# EasyEDA Pro project 电机舵机DCDC驱动板.eprj, board PCB1
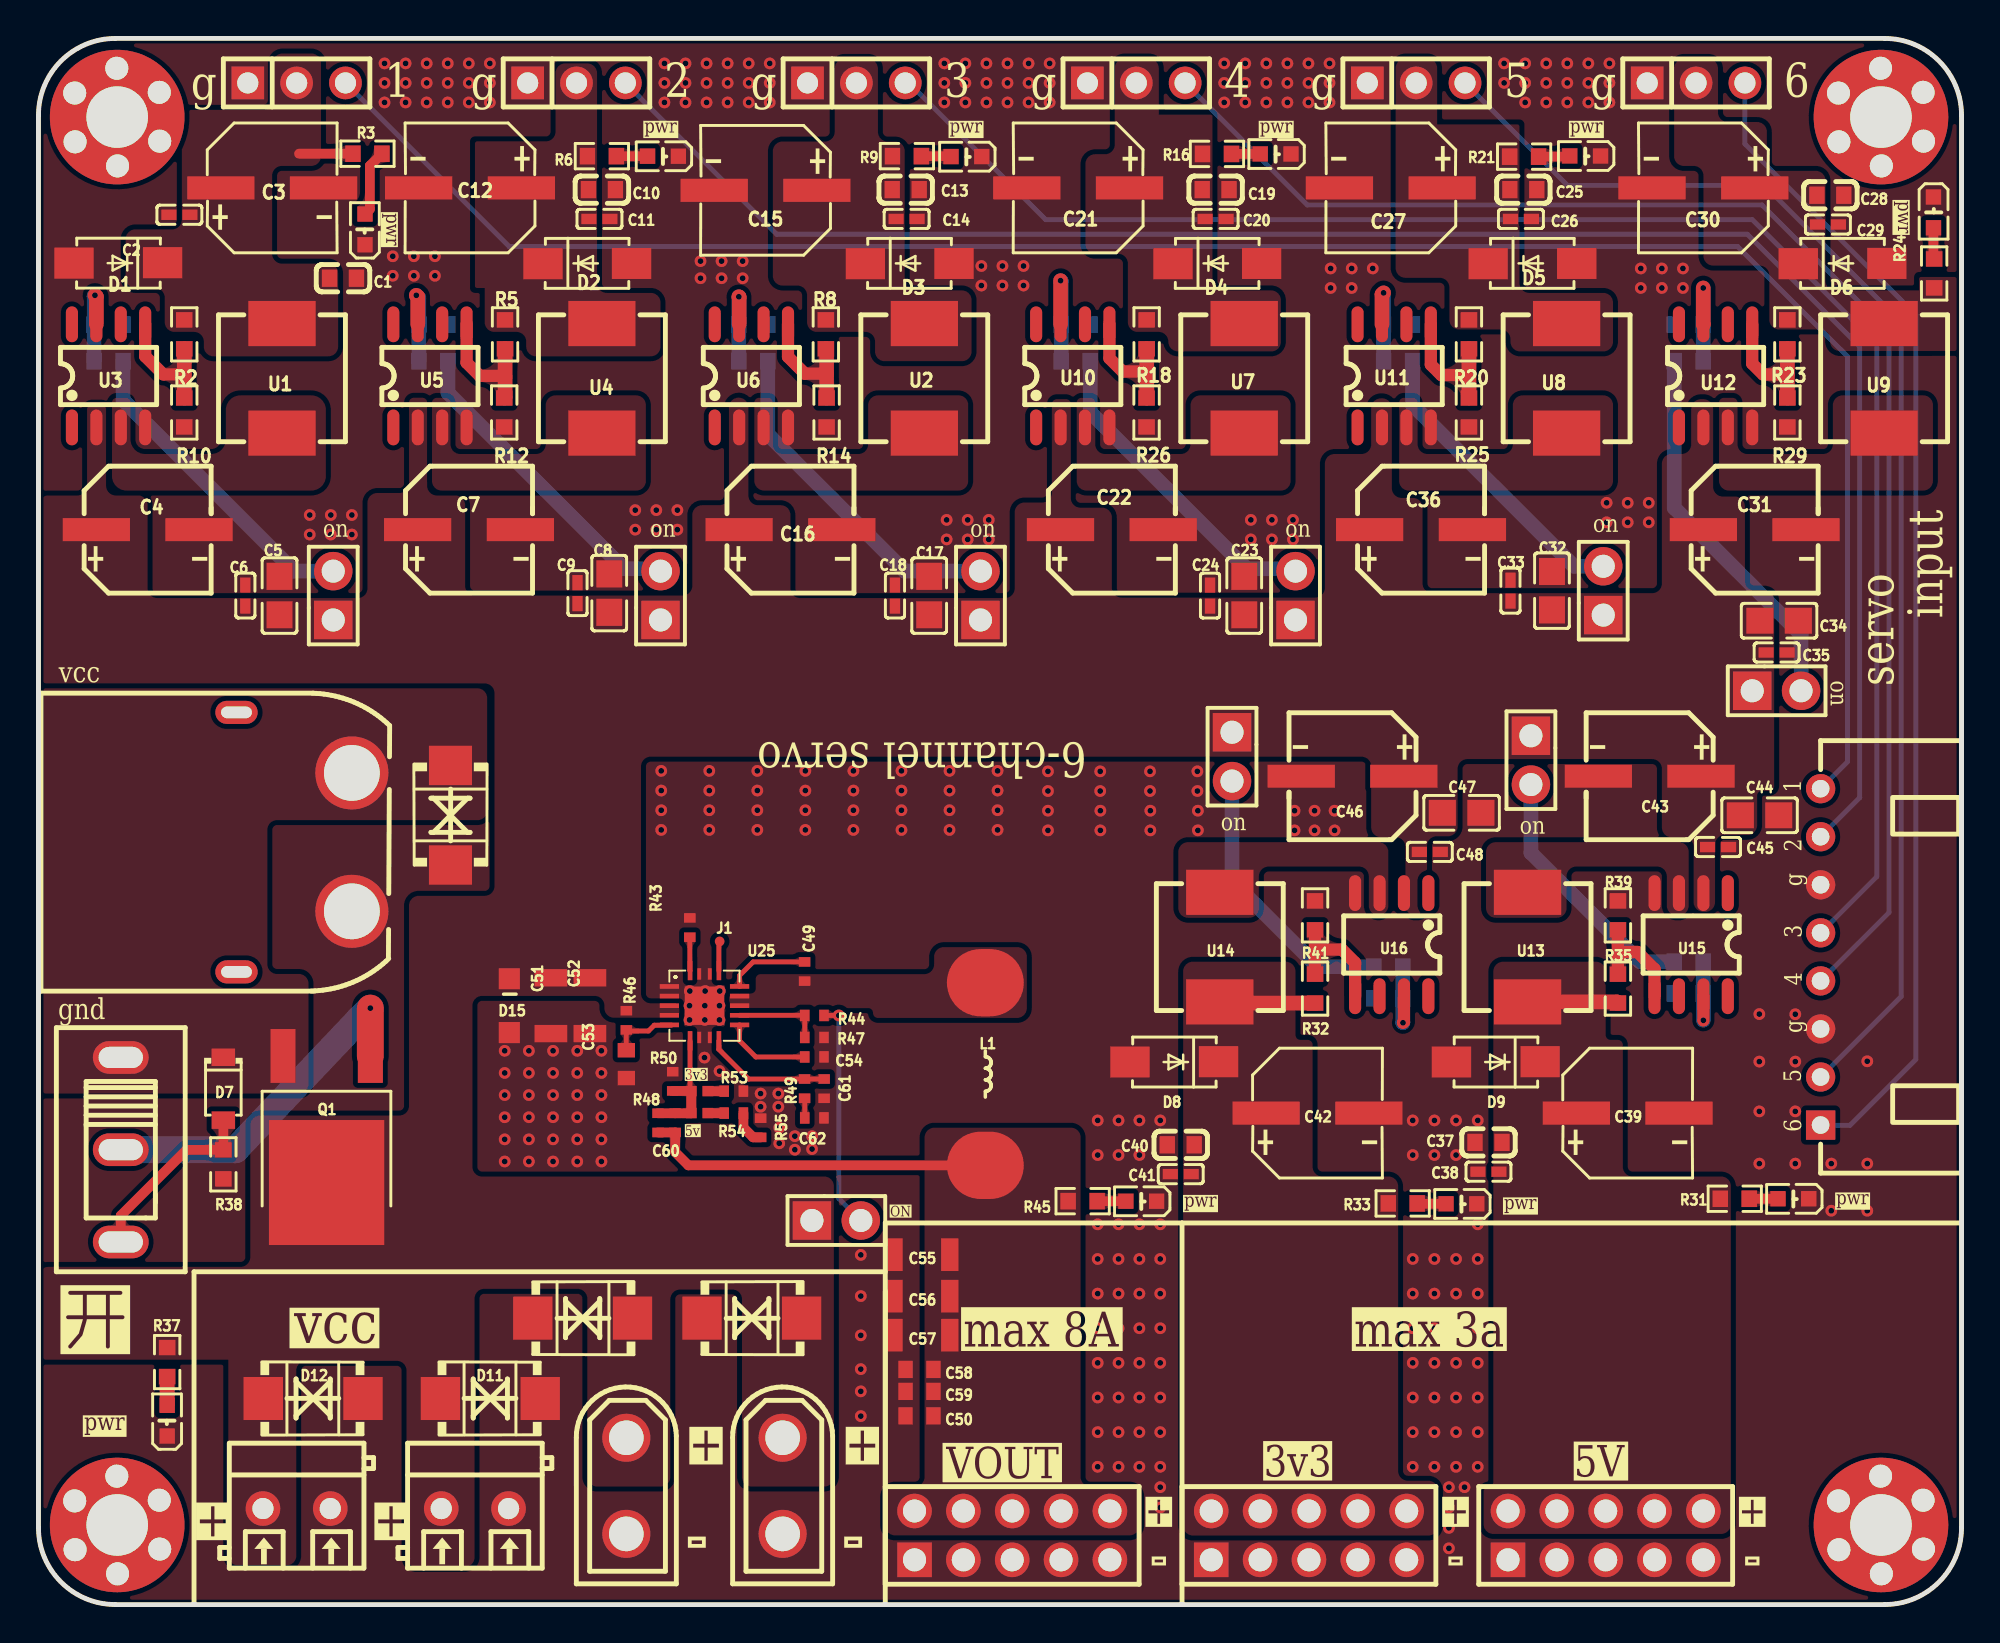
[diagram p2: board, top side]
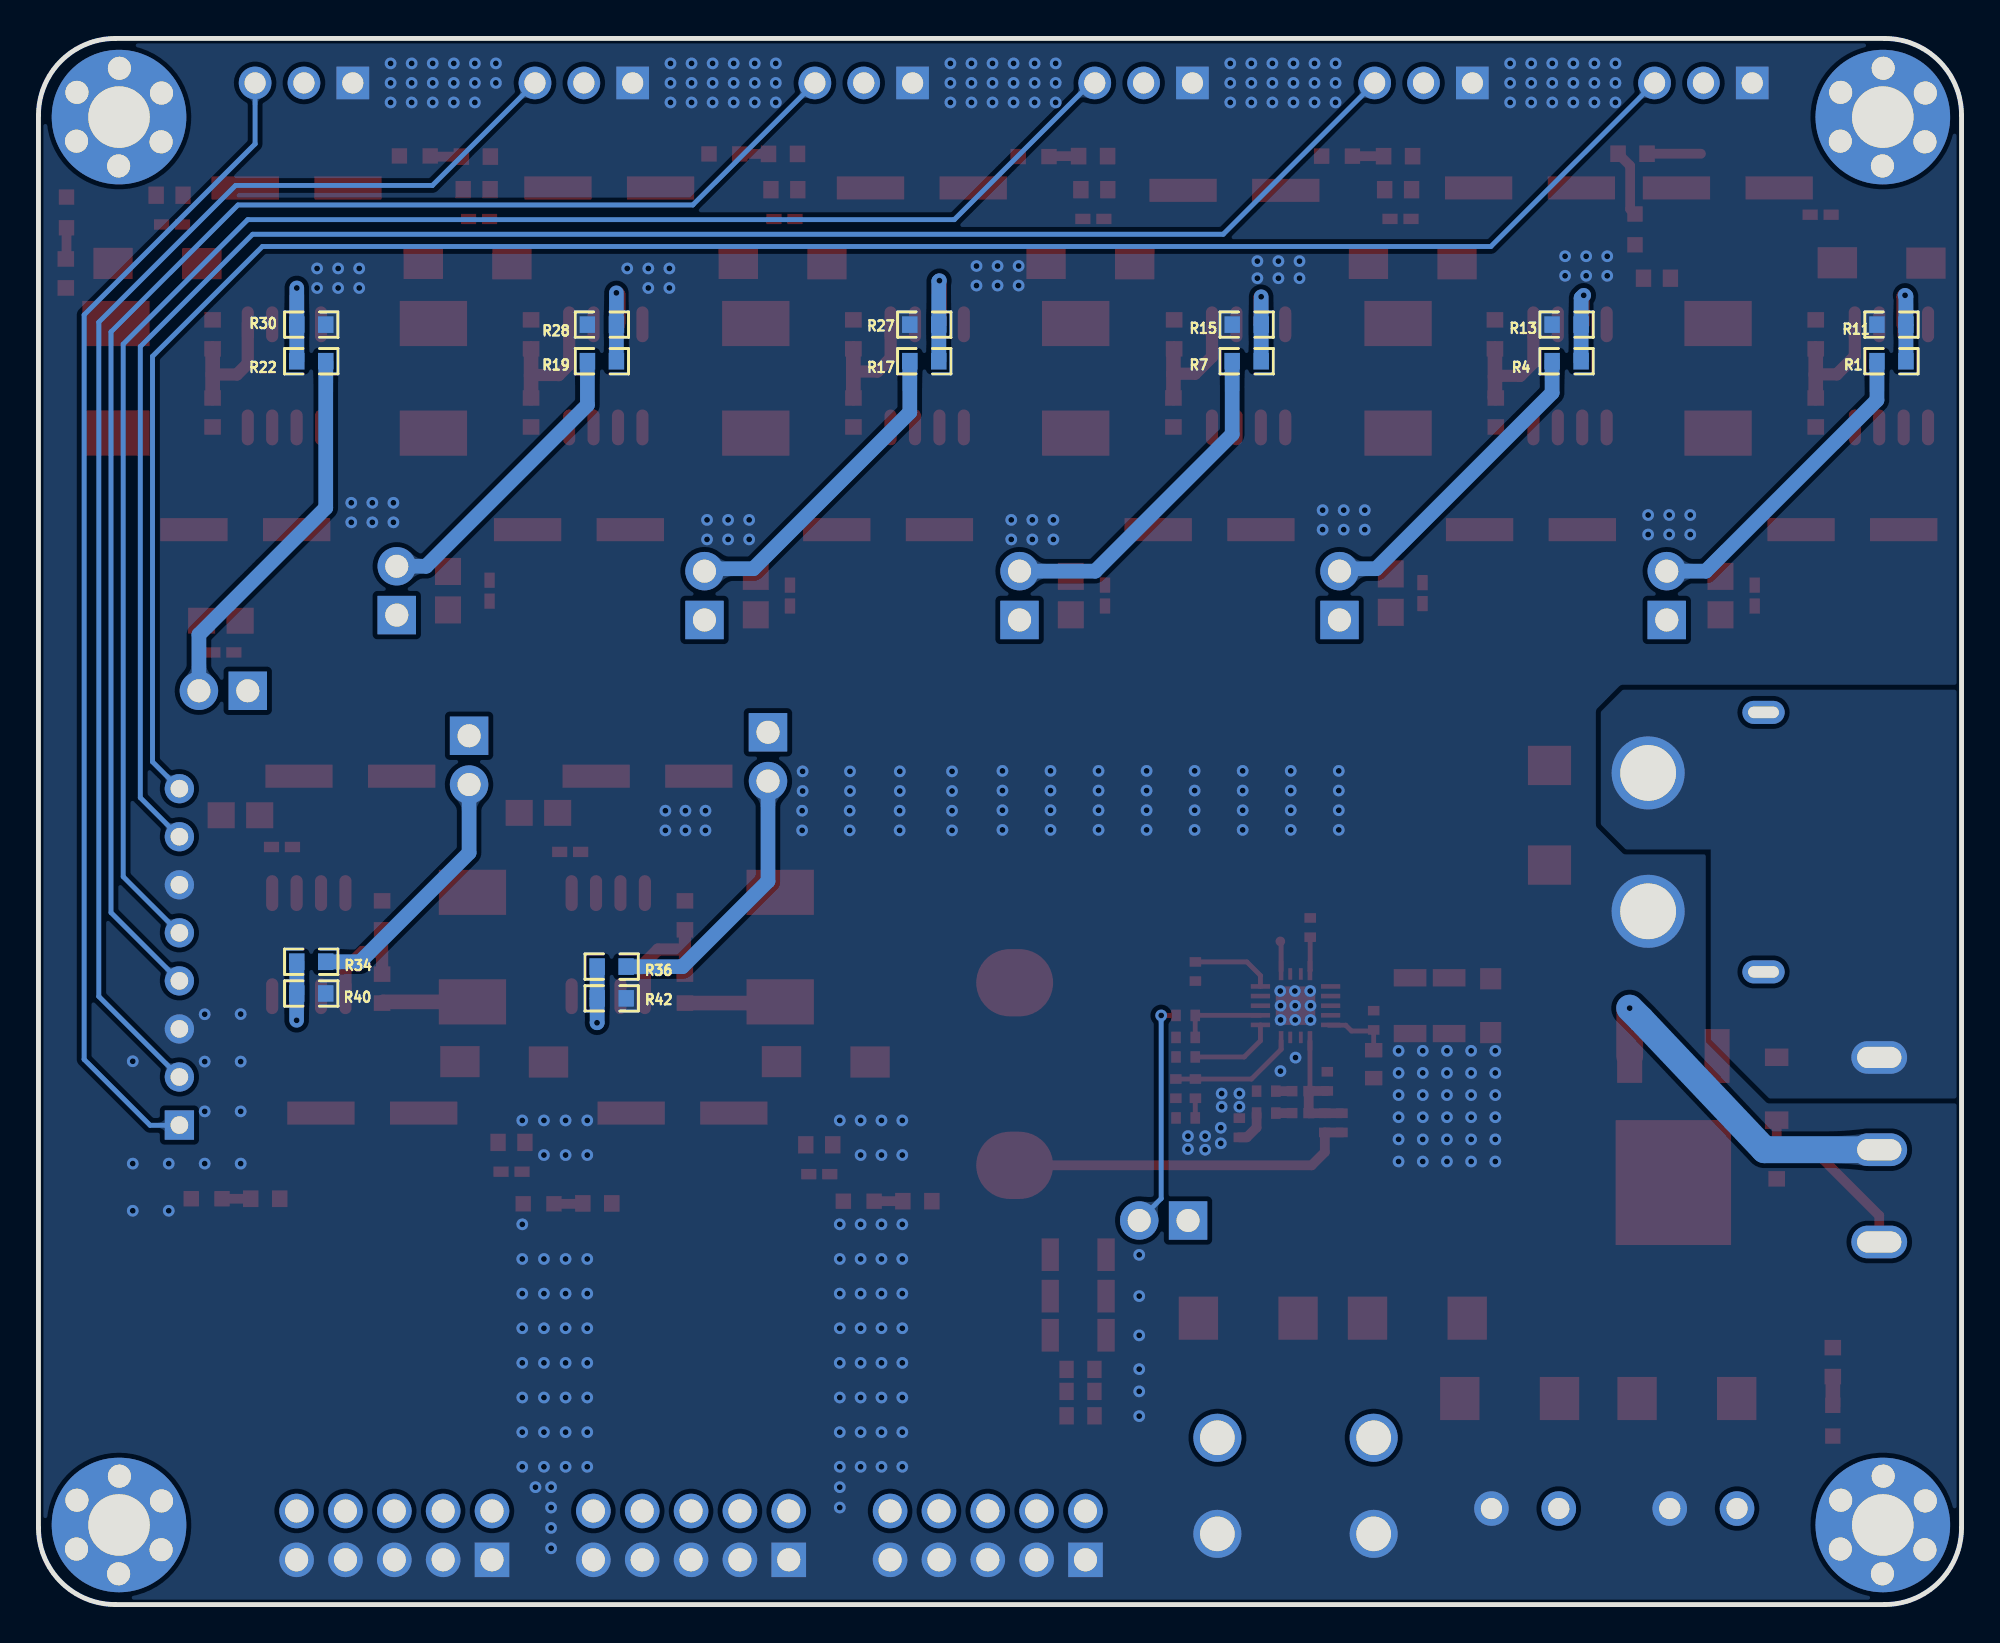
[diagram p3: board, bottom side, seen from below]

Outline 100 x 81.48 mm; copper layers: Top Layer, Bottom Layer. Coordinates in mm from the lower left corner of the outline.
Outline path: 0,77.48 0,4 arc(1.17,1.17) 4,0 96,0 arc(98.83,1.17) 100,4 100,77.48 arc(98.83,80.3) 96,81.48 4,81.48 arc(1.17,80.3) 0,77.48
Stack: Top Layer 0.035mm / Dielectric1 1.51mm FR4 er 4.5 / Bottom Layer 0.035mm

## Design rules (mm)
template: 自定义配置1
spacing copperThickness1oz (default): track to track 0.102, other pairs 0.152 to 0.3
spacing copperThickness2oz: track to track 0.203, other pairs 0.152 to 0.3
track width copperThickness1oz (default): min 0.127, default 0.254, max 2.54
track width copperThickness2oz: min 0.203, default 0.254, max 2.54
differential pair differentialPair (default): width min 0.127, default 0.254, max 2.54; gap min 0.152, default 0.152
via viaSize (default): diameter min 0.5, default 0.61, max 10; hole min 0.3, default 0.305, max 6.3

## Placement (name value [footprint] x y rotation side)
C1  10uF  [C0603]  15.84 69 180 top
C2  100nF  [C0402]  7.33 72.3 0 top
C3  220uF  [CAP-SMD_BD6.3-L6.6-W6.6-LS7.8-FD]  12.15 73.7 0 top
C4  100uF  [CAP-SMD_BD6.3-L6.5-W6.5-LS7.0-FD]  5.68 55.92 0 top
C5  22uF  [C0805]  12.53 52.49 270 top
C6  100nF  [C0402]  10.76 52.49 270 top
C7  100uF  [CAP-SMD_BD6.3-L6.5-W6.5-LS7.0-FD]  22.39 55.92 0 top
C8  22uF  [C0805]  29.68 52.62 270 top
C9  100nF  [C0402]  28.03 52.62 270 top
C10  10uF  [C0603]  29.3 73.61 180 top
C11  100nF  [C0402]  29.17 72.09 180 top
C12  220uF  [CAP-SMD_BD6.3-L6.6-W6.6-LS7.8-FD]  22.44 73.7 180 top
C13  10uF  [C0603]  45.1 73.61 180 top
C14  100nF  [C0402]  45.14 72.09 180 top
C15  220uF  [CAP-SMD_BD6.3-L6.6-W6.6-LS7.8-FD]  37.81 73.57 180 top
C16  100uF  [CAP-SMD_BD6.3-L6.5-W6.5-LS7.0-FD]  39.1 55.92 0 top
C17  22uF  [C0805]  46.32 52.49 270 top
C18  100nF  [C0402]  44.54 52.49 270 top
C19  10uF  [C0603]  61.21 73.61 180 top
C20  100nF  [C0402]  61.21 72.09 180 top
C21  220uF  [CAP-SMD_BD6.3-L6.6-W6.6-LS7.8-FD]  54.06 73.7 180 top
C22  100uF  [CAP-SMD_BD6.3-L6.5-W6.5-LS7.0-FD]  55.82 55.92 0 top
C23  22uF  [C0805]  62.7 52.49 270 top
C24  100nF  [C0402]  60.92 52.49 270 top
C25  10uF  [C0603]  77.21 73.61 180 top
C26  100nF  [C0402]  77.09 72.09 180 top
C27  220uF  [CAP-SMD_BD6.3-L6.6-W6.6-LS7.8-FD]  70.32 73.7 180 top
C28  10uF  [C0603]  93.18 73.32 180 top
C29  100nF  [C0402]  93.05 71.8 180 top
C30  220uF  [CAP-SMD_BD6.3-L6.6-W6.6-LS7.8-FD]  86.58 73.7 180 top
C31  100uF  [CAP-SMD_BD6.3-L6.5-W6.5-LS7.0-FD]  89.24 55.92 0 top
C32  22uF  [C0805]  78.7 52.75 270 top
C33  100nF  [C0402]  76.54 52.75 270 top
C34  22uF  [C0805]  90.51 51.18 180 top
C35  100nF  [C0402]  90.38 49.53 180 top
C36  100uF  [CAP-SMD_BD6.3-L6.5-W6.5-LS7.0-FD]  71.9 55.92 0 top
C37  10uF  [C0603]  75.4 24.04 0 top
C38  100nF  [C0402]  75.4 22.52 0 top
C39  220uF  [CAP-SMD_BD6.3-L6.6-W6.6-LS7.8-FD]  82.64 25.57 0 top
C40  10uF  [C0603]  59.4 23.92 0 top
C41  100nF  [C0402]  59.4 22.39 0 top
C42  220uF  [CAP-SMD_BD6.3-L6.6-W6.6-LS7.8-FD]  66.51 25.57 0 top
C43  100uF  [CAP-SMD_BD6.3-L6.5-W6.5-LS7.0-FD]  83.78 43.09 180 top
C44  22uF  [C0805]  89.5 41.06 180 top
C45  100nF  [C0402]  87.34 39.41 180 top
C46  100uF  [CAP-SMD_BD6.3-L6.5-W6.5-LS7.0-FD]  68.33 43.09 180 top
C47  22uF  [C0805]  74 41.19 180 top
C48  100nF  [C0402]  72.35 39.16 180 top
C49  0402_100nf  [JXLBasicFontprint:0402_CAP]  39.84 32.93 270 top
C50  0603_100nf  [JXLBasicFontprint:0603_CAP]  45.81 9.82 180 top
C51  1206_22uf  [JXLBasicFontprint:1206_CAP]  26.64 31.16 90 top
C52  1206_22uf  [JXLBasicFontprint:1206_CAP]  28.68 31.16 90 top
C53  0603_10uf  [JXLBasicFontprint:0603_CAP]  30.57 28.11 270 top
C54  0402_22nf  [JXLBasicFontprint:0402_CAP]  40.35 28.49 0 top
C55  1206_22uf  [JXLBasicFontprint:1206_CAP]  45.94 18.2 180 top
C56  1206_22uf  [JXLBasicFontprint:1206_CAP]  45.94 16.04 180 top
C57  1206_22uf  [JXLBasicFontprint:1206_CAP]  45.94 14.01 180 top
C58  0603_10uf  [JXLBasicFontprint:0603_CAP]  45.81 12.23 180 top
C59  0603_10uf  [JXLBasicFontprint:0603_CAP]  45.81 11.09 180 top
C60  0402_ADJ  [JXLBasicFontprint:0402_CAP]  33.11 25.06 90 top
C61  0402_39pf  [JXLBasicFontprint:0402_CAP]  40.85 26.84 270 top
C62  0402_3.9nf  [JXLBasicFontprint:0402_CAP]  40.35 25.32 0 top
CN1  XT60PW-M  [CONN-TH_XT60PW-M]  13.3 39.66 0 top
CN2  XT30UPB-M  [CONN-TH_XT30UPB-M]  30.57 6.18 270 top
CN3  XT30UPB-M  [CONN-TH_XT30UPB-M]  38.7 6.18 270 top
D1  SS54  [SMA_L4.3-W2.6-LS5.0-FD]  4.15 69.8 0 top
D2  SS54  [SMA_L4.3-W2.6-LS5.0-FD]  28.54 69.76 180 top
D3  SS54  [SMA_L4.3-W2.6-LS5.0-FD]  45.3 69.76 180 top
D4  SS54  [SMA_L4.3-W2.6-LS5.0-FD]  61.3 69.76 180 top
D5  SS54  [SMA_L4.3-W2.6-LS5.0-FD]  77.69 69.76 180 top
D6  SS54  [SMA_L4.3-W2.6-LS5.0-FD]  93.81 69.76 180 top
D7  BZT52C16  [SOD-123_L2.7-W1.6-LS3.7-RD]  9.61 26.84 270 top
D8  SS54  [SMA_L4.3-W2.6-LS5.0-FD]  59.06 28.23 0 top
D9  SS54  [SMA_L4.3-W2.6-LS5.0-FD]  75.78 28.23 0 top
D10  SMBJ15CA  [SMB_L4.6-W3.6-LS5.4-BI]  21.42 41.06 90 top
D11  SMBJ15CA  [SMB_L4.6-W3.6-LS5.4-BI]  23.5 10.72 180 top
D12  SMBJ15CA  [SMB_L4.6-W3.6-LS5.4-BI]  14.28 10.72 180 top
D13  SMBJ15CA  [SMB_L4.6-W3.6-LS5.4-BI]  28.3 14.9 0 top
D14  SMBJ15CA  [SMB_L4.6-W3.6-LS5.4-BI]  37.09 14.9 0 top
D15  SMFJ15A  [JXLBasicFontprint:Diode_SOD-123F]  24.49 31.16 270 top
H1  PZ254V-11-02P  [HDR-TH_2P-P2.54-V-M]  15.33 52.49 90 top
H2  PZ254V-11-02P  [HDR-TH_2P-P2.54-V-M]  32.35 52.49 90 top
H3  PZ254V-11-02P  [HDR-TH_2P-P2.54-V-M]  48.98 52.49 90 top
H4  PZ254V-11-02P  [HDR-TH_2P-P2.54-V-M]  65.37 52.49 90 top
H5  PZ254V-11-02P  [HDR-TH_2P-P2.54-V-M]  81.37 52.75 90 top
H6  PZ254V-11-02P  [HDR-TH_2P-P2.54-V-M]  90.39 47.54 0 top
H7  PZ254V-11-02P  [HDR-TH_2P-P2.54-V-M]  77.61 43.93 270 top
H8  PZ254V-11-02P  [HDR-TH_2P-P2.54-V-M]  62.06 44.11 270 top
H9  PZ2.54-2*5  [HDR-TH_10P-P2.54-V-M-R2-C5-S2.54-1]  81.5 3.6 0 top
H10  PZ2.54-2*5  [HDR-TH_10P-P2.54-V-M-R2-C5-S2.54-1]  66.07 3.6 0 top
H11  PZ2.54-2*5  [HDR-TH_10P-P2.54-V-M-R2-C5-S2.54-1]  50.63 3.6 0 top
H12  PZ254V-11-03P  [HDR-TH_3P-P2.54-V-M]  13.42 79.16 0 top
H13  PZ254V-11-03P  [HDR-TH_3P-P2.54-V-M]  27.98 79.16 0 top
H14  PZ254V-11-03P  [HDR-TH_3P-P2.54-V-M]  42.53 79.16 0 top
H15  PZ254V-11-03P  [HDR-TH_3P-P2.54-V-M]  57.09 79.16 0 top
H16  PZ254V-11-03P  [HDR-TH_3P-P2.54-V-M]  71.64 79.16 0 top
H17  PZ254V-11-03P  [HDR-TH_3P-P2.54-V-M]  86.19 79.16 0 top
H18  PZ254V-11-02P  [HDR-TH_2P-P2.54-V-M]  41.49 19.98 0 top
J1  Conn_01x01  [JXLConnectFontprint:PinHeader_1x01_P2.54mm_Vertical]  35.42 34.5 0 top
L1  1040_2.2uh  [JXLBasicFontprint:1040_L]  49.24 27.6 270 top
LED1  KT-0603W  [LED0603-R-RD_WHITE]  16.98 71.54 90 top
LED2  KT-0603W  [LED0603-R-RD_WHITE]  32.47 75.35 180 top
LED3  KT-0603W  [LED0603-R-RD_WHITE]  48.25 75.33 180 top
LED4  KT-0603W  [LED0603-R-RD_WHITE]  64.33 75.47 180 top
LED5  KT-0603W  [LED0603-R-RD_WHITE]  80.43 75.36 180 top
LED6  KT-0603W  [LED0603-R-RD_WHITE]  98.54 72.43 270 top
LED7  KT-0603W  [LED0603-R-RD_WHITE]  74 20.85 180 top
LED8  KT-0603W  [LED0603-R-RD_WHITE]  91.25 21.11 180 top
LED9  KT-0603W  [LED0603-R-RD_WHITE]  6.69 9.57 90 top
LED10  KT-0603W  [LED0603-R-RD_WHITE]  57.35 20.99 180 top
Q1  HY19P03D  [TO-252-2_L6.6-W6.1-P4.57-LS9.9-TL-CW]  14.98 25.25 270 top
R1  33k  [R0603]  3.64 64.68 0 bottom
R2  6.2kΩ  [R0603]  7.58 66.08 90 top
R3  4.7kΩ  [R0603]  17.11 75.48 180 top
R4  33k  [R0603]  20.54 64.68 0 bottom
R5  6.2kΩ  [R0603]  24.26 66.08 90 top
R6  4.7kΩ  [R0603]  29.3 75.35 180 top
R7  33k  [R0603]  37.17 64.68 0 bottom
R8  6.2kΩ  [R0603]  40.94 66.08 90 top
R9  4.7kΩ  [R0603]  45.16 75.35 180 top
R10  2kΩ  [R0603]  7.58 62.02 90 top
R11  5k  [R0603]  3.64 66.59 180 bottom
R12  2kΩ  [R0603]  24.22 62.02 90 top
R13  5k  [R0603]  20.54 66.59 180 bottom
R14  2kΩ  [R0603]  40.98 62.02 90 top
R15  5k  [R0603]  37.17 66.59 180 bottom
R16  4.7kΩ  [R0603]  61.28 75.47 180 top
R17  33k  [R0603]  53.94 64.68 0 bottom
R18  6.2kΩ  [R0603]  57.62 66.08 90 top
R19  33k  [R0603]  70.7 64.68 0 bottom
R20  6.2kΩ  [R0603]  74.38 66.08 90 top
R21  4.7kΩ  [R0603]  77.26 75.33 180 top
R22  33k  [R0603]  85.81 64.68 180 bottom
R23  6.2kΩ  [R0603]  90.94 66.08 90 top
R24  4.7kΩ  [R0603]  98.58 69.25 270 top
R25  2kΩ  [R0603]  74.38 62.02 90 top
R26  2kΩ  [R0603]  57.62 62.02 90 top
R27  5k  [R0603]  53.94 66.59 180 bottom
R28  5k  [R0603]  70.7 66.59 180 bottom
R29  2kΩ  [R0603]  90.94 62.02 90 top
R30  5k  [R0603]  85.81 66.59 0 bottom
R31  4.7kΩ  [R0603]  88.21 21.11 180 top
R32  6.2kΩ  [R0603]  66.38 32.05 270 top
R33  4.7kΩ  [R0603]  70.94 20.87 180 top
R34  33k  [R0603]  85.81 33.44 180 bottom
R35  6.2kΩ  [R0603]  82.13 32.05 270 top
R36  33k  [R0603]  70.19 33.19 180 bottom
R37  4.7k  [R0603]  6.69 12.61 90 top
R38  10kΩ  [R0603]  9.61 22.9 90 top
R39  2kΩ  [R0603]  82.13 35.86 270 top
R40  5k  [R0603]  85.81 31.79 0 bottom
R41  3.6k  [R0603]  66.38 35.86 270 top
R42  5k  [R0603]  70.19 31.54 0 bottom
R43  0402_47K  [JXLBasicFontprint:0402_RES]  33.87 35.22 90 top
R44  0402_ADJ  [JXLBasicFontprint:0402_RES]  40.35 30.65 0 top
R45  4.7kΩ  [R0603]  54.3 20.99 180 top
R46  0402_10  [JXLBasicFontprint:0402_RES]  30.57 30.39 90 top
R47  0402_ADJ  [JXLBasicFontprint:0402_RES]  40.35 29.5 0 top
R48  0402_10K  [JXLBasicFontprint:0402_RES]  32.22 25.06 90 top
R49  0402_4.7K  [JXLBasicFontprint:0402_RES]  39.84 26.84 270 top
R50  0402_ADJ  [JXLBasicFontprint:0402_RES]  32.98 27.22 90 top
R51  0Ω  [R0402]  34.38 26.71 180 top
R52  0Ω  [R0402]  34.38 25.57 180 top
R53  0402_2.2K  [JXLBasicFontprint:0402_RES]  36.16 26.71 180 top
R54  0402_1.33K  [JXLBasicFontprint:0402_RES]  36.16 25.57 0 top
R55  0402_10  [JXLBasicFontprint:0402_RES]  37.55 24.81 90 top
SW1  SS12D10G6  [SW-TH_SHOU-HAN_SS12D10G4]  4.28 23.66 270 top
U1  15uH  [IND-SMD_L7.2-W6.6_GPSR07X0]  12.66 63.8 90 top
U2  15uH  [IND-SMD_L7.2-W6.6_GPSR07X0]  46.06 63.8 90 top
U3  TD1310  [SOP-8_L4.9-W3.9-P1.27-LS6.0-BL]  3.64 63.92 0 top
U4  15uH  [IND-SMD_L7.2-W6.6_GPSR07X0]  29.3 63.8 90 top
U5  TD1310  [SOP-8_L4.9-W3.9-P1.27-LS6.0-BL]  20.36 63.92 0 top
U6  TD1310  [SOP-8_L4.9-W3.9-P1.27-LS6.0-BL]  37.07 63.92 0 top
U7  15uH  [IND-SMD_L7.2-W6.6_GPSR07X0]  62.7 63.8 90 top
U8  15uH  [IND-SMD_L7.2-W6.6_GPSR07X0]  79.46 63.8 90 top
U9  15uH  [IND-SMD_L7.2-W6.6_GPSR07X0]  95.97 63.8 90 top
U10  TD1310  [SOP-8_L4.9-W3.9-P1.27-LS6.0-BL]  53.78 63.92 0 top
U11  TD1310  [SOP-8_L4.9-W3.9-P1.27-LS6.0-BL]  70.5 63.92 0 top
U12  TD1310  [SOP-8_L4.9-W3.9-P1.27-LS6.0-BL]  87.21 63.92 0 top
U13  15uH  [IND-SMD_L7.2-W6.6_GPSR07X0]  77.43 34.2 270 top
U14  15uH  [IND-SMD_L7.2-W6.6_GPSR07X0]  61.43 34.2 270 top
U15  TD1310  [SOP-8_L4.9-W3.9-P1.27-LS6.0-BL]  85.94 34.33 180 top
U16  TD1310  [SOP-8_L4.9-W3.9-P1.27-LS6.0-BL]  70.37 34.33 180 top
U17  -  [M3]  4.09 77.38 0 top
U18  -  [M3]  4.09 4.14 0 top
U19  -  [M3]  95.81 77.38 0 top
U20  -  [M3]  95.81 4.14 0 top
U21  DB301V-3.5-2P-GN-S  [CONN-TH_DB301V-3.5-2P-GN]  13.42 4.99 0 top
U22  DB301V-3.5-2P-GN-S  [CONN-TH_DB301V-3.5-2P-GN]  22.69 4.99 0 top
U24  BX-XH2.54-8PWZ  [CONN-TH_8P-P2.50_BX-XH2.54-8PWZ]  92.67 33.7 90 top
U25  TPS54821  [JXLChipFontprint:TPS54620RHLR]  34.63 31.16 270 top

## Footprints (pads in the part's own frame, mm; a bottom-side part is the same pattern mirrored in y, then rotated)
C0402
  rect 0.79x0.54 smd: 1(-0.545,0) 2(0.545,0)
C0603
  rect 0.8x0.9 smd: 1(-0.7,0) 2(0.7,0)
C0805
  rect 1.41x1.35 smd: 1(-1,0) 2(1,0)
CAP-SMD_BD6.3-L6.5-W6.5-LS7.0-FD
  rect 3.5x1.2 smd: 1(-2.67,0) 2(2.67,0)
CAP-SMD_BD6.3-L6.6-W6.6-LS7.8-FD
  rect 3.5x1.2 smd: 1(-2.67,0) 2(2.67,0)
CONN-TH_8P-P2.50_BX-XH2.54-8PWZ
  rect 1.524x1.524 hole 0.914: 1(-8.75,0)
  round 1.524 hole 0.914: 2(-6.25,0) 3(-3.75,0) 4(-1.25,0) 5(1.25,0) 6(3.75,0) 7(6.25,0) 8(8.75,0)
CONN-TH_DB301V-3.5-2P-GN
  round 1.8 hole 1.1: 1(-1.75,0) 2(1.75,0)
CONN-TH_XT30UPB-M
  round 2.5 hole 1.8: 1(-2.5,0) 2(2.5,0)
CONN-TH_XT60PW-M
  round 3.8 hole 2.9: 1(3,-3.6) 2(3,3.6)
  oval 2.2x1.2 hole 1.6x0.6: 3(-3,6.75) 4(-3,-6.75)
HDR-TH_2P-P2.54-V-M
  rect 2x2 hole 1.2: 1(-1.27,0)
  round 2 hole 1.2: 2(1.27,0)
HDR-TH_3P-P2.54-V-M
  rect 1.7x1.7 hole 1.1: 1(-2.54,0)
  round 1.7 hole 1.1: 2(0,0) 3(2.54,0)
HDR-TH_10P-P2.54-V-M-R2-C5-S2.54-1
  rect 1.8x1.8 hole 1.2: 1(-5.08,-1.27)
  round 1.8 hole 1.2: 2(-5.08,1.27) 3(-2.54,-1.27) 4(-2.54,1.27) 5(0,-1.27) 6(0,1.27) 7(2.54,-1.27) 8(2.54,1.27) 9(5.08,-1.27) 10(5.08,1.27)
IND-SMD_L7.2-W6.6_GPSR07X0
  rect 2.35x3.5 smd: 1(-2.85,0) 2(2.85,0)
JXLBasicFontprint:0402_CAP
  rect 0.5x0.6 smd: 1(-0.5,0) 2(0.5,0)
JXLBasicFontprint:0402_RES
  rect 0.5x0.6 smd: 1(-0.5,0) 2(0.5,0)
JXLBasicFontprint:0603_CAP
  rect 0.75x0.9 smd: 1(-0.73,0) 2(0.72,0)
JXLBasicFontprint:1040_L
  rrect 3.5x4 smd: 1(-4.75,0) 2(4.75,0)
JXLBasicFontprint:1206_CAP
  rect 0.9x1.7 smd: 1(-1.45,0) 2(1.45,0)
JXLBasicFontprint:Diode_SOD-123F
  rect 1.1x1.1 smd: 1(-1.4,0) 2(1.4,0)
JXLChipFontprint:TPS54620RHLR
  rect 1x0.24 smd: 1(-1.825,-0.75) 7(1.825,-0.75) 10(1.825,0.75) 16(-1.825,0.75)
  rect 0.24x1 smd: 2(-1,-1.825) 3(-0.5,-1.825) 4(0,-1.825) 5(0.5,-1.825) 6(1,-1.825) 11(1,1.825) 12(0.5,1.825) 13(0,1.825) 14(-0.5,1.825) 15(-1,1.825)
  rect 0.6x0.2 smd: 8(1.65,-0.275) 9(1.65,0.275) 17(-1.65,0.275) 18(-1.65,-0.275)
  rect 2x2.05 smd: 18(0,0)
JXLConnectFontprint:PinHeader_1x01_P2.54mm_Vertical
  round 0.5 smd: 1(0,0)
LED0603-R-RD_WHITE
  rect 0.8x0.8 smd: 1(0.8,0) 2(-0.8,0)
M3
  round 1.2 hole 1.2: (-2.209,1.252) (-2.189,-1.288) (-0.02,2.54) (0.02,-2.54) (2.189,1.288) (2.209,-1.252)
  round 7 hole 3.2: 1(0,0)
R0402
  rect 0.566x0.54 smd: 1(-0.433,0) 2(0.433,0)
R0603
  rect 0.806x0.864 smd: 1(-0.753,0) 2(0.753,0)
SMA_L4.3-W2.6-LS5.0-FD
  rect 2.046x1.62 smd: 1(-2.304,-0.009) 2(2.304,0.009)
SMB_L4.6-W3.6-LS5.4-BI
  rect 2.047x2.241 smd: 1(-2.591,0) 2(2.591,0)
SOD-123_L2.7-W1.6-LS3.7-RD
  rect 0.91x1.22 smd: 1(-1.635,0) 2(1.635,0)
SOP-8_L4.9-W3.9-P1.27-LS6.0-BL
  oval 0.63x1.865 smd: 1(-1.905,-2.683) 2(-0.635,-2.683) 3(0.635,-2.683) 4(1.905,-2.683) 5(1.905,2.683) 6(0.635,2.683) 7(-0.635,2.683) 8(-1.905,2.683)
SW-TH_SHOU-HAN_SS12D10G4
  oval 1.7x2.9 hole 1.1x2.3: 1(-4.8,0) 2(0,0) 3(4.8,0)
TO-252-2_L6.6-W6.1-P4.57-LS9.9-TL-CW
  rect 2.8x1.3 smd: 1(-3.292,2.273) 3(-3.292,-2.273)
  rect 6.5x6 smd: 2(3.292,0)

## Nets
As in the schematic, except:
GND: C1.1 C2.1 C3.2 C4.2 C5.1 C6.1 C7.2 C8.1 C9.1 C10.1 C11.1 C12.2 C13.1 C14.1 C15.2 C16.2 C17.1 C18.1 C19.1 C20.1 C21.2 C22.2 C23.1 C24.1 C25.1 C26.1 C27.2 C28.1 C29.1 C30.2 C31.2 C32.1 C33.1 C34.1 C35.1 C36.2 C37.1 C38.1 C39.2 C40.1 C41.1 C42.2 C43.2 C44.1 C45.1 C46.2 C47.1 C48.1 C50.2 C51.1 C52.1 C53.2 C54.2 C55.2 C56.2 C57.2 C58.2 C59.2 C61.2 C62.2 CN1.1 CN2.2 CN3.2 D1.1 D2.1 D3.1 D4.1 D5.1 D6.1 D8.1 D9.1 D10.1 D11.1 D12.1 D13.1 D14.1 D15.2 H9.1 H9.3 H9.5 H9.7 H9.9 H10.1 H10.3 H10.5 H10.7 H10.9 H11.1 H11.3 H11.5 H11.7 H11.9 H12.1 H13.1 H14.1 H15.1 H16.1 H17.1 LED1.2 LED2.2 LED3.2 LED4.2 LED5.2 LED6.2 LED7.2 LED8.2 LED9.2 LED10.2 R10.1 R11.1 R12.1 R13.1 R14.1 R15.1 R25.1 R26.1 R27.1 R28.1 R29.1 R30.1 R38.1 R39.1 R40.1 R41.1 R42.1 R43.2 R47.2 R50.2 R53.1 R55.2 U3.4 U5.4 U6.4 U10.4 U11.4 U12.4 U15.4 U16.4 U21.2 U22.2 U24.3 U24.6 U25.2 U25.3 U25.8 U25.9 U25.17 U25.18
VOUT: C50.1 C55.1 C56.1 C57.1 C58.1 C59.1 C60.1 H11.2 H11.4 H11.6 H11.8 H11.10 L1.2 R45.2 R48.1
$2N9: C49.2 L1.1 U25.13 U25.14

Pads without a net: CN1 3 4; U3 1 6 8; U5 1 6 8; U6 1 6 8; U10 1 6 8; U11 1 6 8; U12 1 6 8; U15 1 6 8; U16 1 6 8; U17 1; U18 1; U19 1; U20 1

## Via types
v1: diameter 0.61, hole 0.305, Top Layer to Bottom Layer, 364 vias

## Routing (per net, layer and track width the routed paths; a pad name or vN(x,y) marks a point on that pad's centre or on a via; arc(x,y) is an arc through that point)
GND:
  vias: v1(14.11,56.68) v1(14.11,55.67) v1(15.2,56.68) v1(15.2,55.67) v1(16.3,56.68) v1(16.3,55.67) v1(18,80.18) v1(18,79.16) v1(18,78.15) v1(18.42,70.14) v1(18.42,69.13) v1(19.09,80.18) v1(19.09,79.16) v1(19.09,78.15) v1(19.52,70.14) v1(19.52,69.13) v1(20.19,80.18) v1(20.19,79.16) v1(20.19,78.15) v1(20.62,70.14) v1(20.62,69.13) v1(21.28,80.18) v1(21.28,79.16) v1(21.28,78.15) v1(22.38,80.18) v1(22.38,79.16) v1(22.38,78.15) v1(23.47,80.18) v1(23.47,79.16) v1(23.47,78.15) v1(24.24,28.81) v1(24.24,27.66) v1(24.24,26.51) v1(24.24,25.35) v1(24.24,24.2) v1(24.24,23.05) v1(25.5,28.81) v1(25.5,27.66) v1(25.5,26.51) v1(25.5,25.35) v1(25.5,24.2) v1(25.5,23.05) v1(26.76,28.81) v1(26.76,27.66) v1(26.76,26.51) v1(26.76,25.35) v1(26.76,24.2) v1(26.76,23.05) v1(28.02,28.81) v1(28.02,27.66) v1(28.02,26.51) v1(28.02,25.35) v1(28.02,24.2) v1(28.02,23.05) v1(29.27,28.81) v1(29.27,27.66) v1(29.27,26.51) v1(29.27,25.35) v1(29.27,24.2) v1(29.27,23.05) v1(31.03,56.94) v1(31.03,55.92) v1(32.13,56.94) v1(32.13,55.92) v1(32.38,43.37) v1(32.38,42.35) v1(32.38,41.32) v1(32.38,40.3) v1(32.55,80.18) v1(32.55,79.16) v1(32.55,78.15) v1(33.22,56.94) v1(33.22,55.92) v1(33.65,80.18) v1(33.65,79.16) v1(33.65,78.15) v1(33.87,31.92) v1(33.85,31.16) v1(33.85,30.41) v1(34.43,69.89) v1(34.43,69) v1(34.63,28.45) v1(34.74,80.18) v1(34.74,79.16) v1(34.74,78.15) v1(34.67,31.92) v1(34.65,31.16) v1(34.65,30.41) v1(34.88,43.37) v1(34.88,42.35) v1(34.88,41.32) v1(34.88,40.3) v1(35.43,31.92) v1(35.41,31.16) v1(35.41,30.41) v1(35.42,27.75) v1(35.52,69.89) v1(35.52,69) v1(35.84,80.18) v1(35.84,79.16) v1(35.84,78.15) v1(36.62,69.89) v1(36.62,69) v1(36.93,80.18) v1(36.93,79.16) v1(36.93,78.15) v1(37.38,43.37) v1(37.38,42.35) v1(37.38,41.32) v1(37.38,40.3) v1(37.55,26.58) v1(37.55,25.9) v1(38.03,80.18) v1(38.03,79.16) v1(38.03,78.15) v1(38.47,26.58) v1(38.47,25.9) v1(38.52,24.81) v1(38.52,24) v1(39.33,24.37) v1(39.33,23.66) v1(39.88,43.37) v1(39.88,42.35) v1(39.88,41.32) v1(39.88,40.3) v1(40.23,24.37) v1(40.23,23.7) v1(42.38,43.37) v1(42.38,42.35) v1(42.38,41.32) v1(42.38,40.3) v1(42.76,18.19) v1(42.76,16.05) v1(42.76,14.01) v1(42.76,12.25) v1(42.76,11.09) v1(42.76,9.8) v1(44.88,43.37) v1(44.88,42.35) v1(44.88,41.32) v1(44.88,40.3) v1(47.1,80.18) v1(47.1,79.16) v1(47.1,78.15) v1(47.22,56.43) v1(47.22,55.41) v1(47.37,43.37) v1(47.37,42.35) v1(47.37,41.32) v1(47.37,40.3) v1(48.2,80.18) v1(48.2,79.16) v1(48.2,78.15) v1(48.32,56.43) v1(48.32,55.41) v1(49.03,69.64) v1(49.03,68.62) v1(49.29,80.18) v1(49.29,79.16) v1(49.29,78.15) v1(49.41,56.43) v1(49.41,55.41) v1(49.87,43.37) v1(49.87,42.35) v1(49.87,41.32) v1(49.87,40.3) v1(50.13,69.64) v1(50.13,68.62) v1(50.39,80.18) v1(50.39,79.16) v1(50.39,78.15) v1(51.22,69.64) v1(51.22,68.62) v1(51.49,80.18) v1(51.49,79.16) v1(51.49,78.15) v1(52.49,43.35) v1(52.49,42.32) v1(52.49,41.3) v1(52.49,40.28) v1(52.58,80.18) v1(52.58,79.16) v1(52.58,78.15) v1(55.08,25.19) v1(55.08,23.39) v1(55.08,19.78) v1(55.08,17.98) v1(55.08,16.18) v1(55.08,14.38) v1(55.08,12.57) v1(55.08,10.77) v1(55.08,8.97) v1(55.08,7.17) v1(55.21,43.35) v1(55.21,42.32) v1(55.22,41.3) v1(55.22,40.28) v1(56.16,25.19) v1(56.16,23.39) v1(56.16,19.78) v1(56.16,17.98) v1(56.16,16.18) v1(56.16,14.38) v1(56.16,12.57) v1(56.16,10.77) v1(56.16,8.97) v1(56.16,7.17) v1(57.25,25.19) v1(57.25,23.39) v1(57.25,19.78) v1(57.25,17.98) v1(57.25,16.18) v1(57.25,14.38) v1(57.25,12.57) v1(57.25,10.77) v1(57.25,8.97) v1(57.25,7.17) v1(57.8,43.35) v1(57.8,42.32) v1(57.82,41.3) v1(57.82,40.28) v1(58.33,25.19) v1(58.33,19.78) v1(58.33,17.98) v1(58.33,16.18) v1(58.33,14.38) v1(58.33,12.57) v1(58.33,10.77) v1(58.33,8.97) v1(58.33,7.17) v1(58.33,6.11) v1(58.33,5.05) v1(60.26,43.35) v1(60.26,42.32) v1(60.29,41.3) v1(60.29,40.28) v1(61.66,80.18) v1(61.66,79.16) v1(61.66,78.15) v1(62.75,80.18) v1(62.75,79.16) v1(62.75,78.15) v1(63.04,56.43) v1(63.04,55.41) v1(63.85,80.18) v1(63.85,79.16) v1(63.85,78.15) v1(64.14,56.43) v1(64.14,55.41) v1(64.94,80.18) v1(64.94,79.16) v1(64.94,78.15) v1(65.23,56.43) v1(65.23,55.41) v1(65.32,41.3) v1(65.32,40.28) v1(66.04,80.18) v1(66.04,79.16) v1(66.04,78.15) v1(66.36,41.3) v1(66.36,40.28) v1(67.13,80.18) v1(67.13,79.16) v1(67.13,78.15) v1(67.19,69.51) v1(67.19,68.49) v1(67.4,41.3) v1(67.4,40.28) v1(68.29,69.51) v1(68.29,68.49) v1(69.38,69.51) v1(71.46,25.19) v1(71.46,23.39) v1(71.46,17.98) v1(71.46,16.18) v1(71.46,14.38) v1(71.46,12.57) v1(71.46,10.77) v1(71.46,8.97) v1(71.46,7.17) v1(72.59,25.19) v1(72.59,23.39) v1(72.59,17.98) v1(72.59,16.18) v1(72.59,14.38) v1(72.59,12.57) v1(72.59,10.77) v1(72.59,8.97) v1(72.59,7.17) v1(73.34,6.11) v1(73.34,5.05) v1(73.34,3.99) v1(73.34,2.93) v1(73.72,25.19) v1(73.72,23.39) v1(73.72,17.98) v1(73.72,16.18) v1(73.72,14.38) v1(73.72,12.57) v1(73.72,10.77) v1(73.72,8.97) v1(73.72,7.17) v1(74.16,6.11) v1(74.84,25.19) v1(74.84,19.78) v1(74.84,17.98) v1(74.84,16.18) v1(74.84,14.38) v1(74.84,12.57) v1(74.84,10.77) v1(74.84,8.97) v1(74.84,7.17) v1(76.21,80.18) v1(76.21,79.16) v1(77.31,80.18) v1(77.31,79.16) v1(77.31,78.15) v1(78.4,80.18) v1(78.4,79.16) v1(78.4,78.15) v1(79.5,80.18) v1(79.5,79.16) v1(79.5,78.15) v1(80.59,80.18) v1(80.59,79.16) v1(80.59,78.15) v1(81.54,57.32) v1(81.54,56.3) v1(81.69,80.18) v1(81.69,79.16) v1(81.69,78.15) v1(82.64,57.32) v1(82.64,56.3) v1(83.32,69.51) v1(83.32,68.49) v1(83.73,57.32) v1(83.73,56.3) v1(84.42,69.51) v1(84.42,68.49) v1(85.51,69.51) v1(85.51,68.49) v1(89.49,30.72) v1(89.49,28.25) v1(89.49,25.66) v1(89.49,22.94) v1(91.36,30.71) v1(91.36,28.25) v1(91.36,25.66) v1(91.36,22.94) v1(93.23,22.94) v1(93.23,20.49) v1(95.1,28.26) v1(95.1,22.94) v1(95.1,20.49)
FB: length 6.4
  Top Layer w0.254: U25.7 33.88,26.77
  Top Layer w0.508: R50.1 33.94,26.72 R51.2 R52.2 33.94,25.56 C60.2 R48.2
SER1: length 107.1
  Bottom Layer w0.254: H12.3 24.47,70.65 88.35,70.65 94.07,64.94 94.07,43.84 U24.8
SER2: length 96.2
  Bottom Layer w0.254: U24.7 94.7,41.98 94.7,65.45 88.86,71.29 38.39,71.29 H13.3
SER3: length 88
  Bottom Layer w0.254: U24.5 95.59,37.87 95.59,65.57 89.12,72.05 52.37,72.05 45.26,79.16 H14.3
SER4: length 77.2
  Bottom Layer w0.254: H15.3 65.98,72.81 89.62,72.81 96.23,66.21 96.23,36 U24.4
SER5: length 68.8
  Bottom Layer w0.254: U24.2 96.86,31.64 96.86,66.72 89.75,73.83 79.51,73.83 H16.3
SER6: length 60.9
  Bottom Layer w0.254: 88.74,79.16 88.74,75.99 97.62,67.1 97.62,28.36 94.2,24.93 92.69,24.93 U24.1
VOUT: length 18.3
  Top Layer w0.508: R48.1 C60.1 33.11,23.54 33.79,22.85 L1.2
VOUT1: length 2.8
  Top Layer w0.508: R3.2 13.55,75.48
VOUT1-3.3: length 5
  Top Layer w0.762: U14.2 61.49,31.29 R32.2
VOUT1-5: length 4.7
  Top Layer w0.762: U13.2 82.07,31.35 R35.2
$1N956: length 6.6
  Top Layer w0.635: 7.58,64 6.49,64 5.55,64.94 U3.5
  Top Layer w0.762: R2.1 R10.2
$1N2956: length 6.9
  Top Layer w0.635: U5.5 22.26,64.61 22.95,63.92 24.22,63.92 24.26,63.88
  Top Layer w0.762: R5.1 24.26,62.81 R12.2
$1N3279: length 6.6
  Top Layer w0.635: 40.98,64.03 39.86,64.03 38.98,64.91 U6.5
  Top Layer w0.762: R8.1 40.98,65.29 R14.2
$1N3602: length 6.5
  Top Layer w0.635: U10.5 55.69,64.84 56.38,64.15 57.62,64.15
  Top Layer w0.762: R26.2 57.62,62.78 R18.1
$1N3925: length 6.7
  Top Layer w0.635: 90.94,63.99 89.68,63.99 89.12,64.56 U12.5
  Top Layer w0.762: R29.2 R23.1
$1N4248: length 6.9
  Top Layer w0.635: 74.38,63.96 72.94,63.96 72.4,64.51 U11.5
  Top Layer w0.762: R25.2 R20.1
$1N11484: length 6
  Top Layer w0.635: U15.5 84.04,33.06 83.15,33.95 82.14,33.95 82.13,33.96 ; R39.2 82.13,33.96 ; 82.13,33.96 R35.1
$1N11808: length 6.4
  Top Layer w0.635: 66.38,34 66.46,34.08 67.78,34.08 68.47,33.39 U16.5 ; 66.38,34 R41.2 ; 66.38,34 R32.1
$1N35762: length 6.5
  Top Layer w0.762: U10.7 v1(53.15,68.88)
  Bottom Layer w0.762: R17.1 R27.2 53.18,68.84 v1(53.15,68.88)
$1N35925: length 5
  Top Layer w0.762: U3.7 3.01,68.04 v1(2.94,68.11)
  Bottom Layer w0.762: R1.1 R11.2 2.89,68.07 v1(2.94,68.11)
$1N35986: length 5
  Top Layer w0.762: U5.7 19.72,68.04 v1(19.65,68.11)
  Bottom Layer w0.762: v1(19.65,68.11) 19.78,67.98 R13.2 R4.1
$1N36186: length 4.8
  Top Layer w0.762: v1(36.42,68.04) 36.44,68.02 U6.7
  Bottom Layer w0.762: R7.1 R15.2 v1(36.42,68.04)
$1N36312: length 5.7
  Top Layer w0.762: U12.7 86.57,66.61 v1(86.57,68.49)
  Bottom Layer w0.762: v1(86.57,68.49) R30.2 R22.1
$1N36350: length 5.2
  Top Layer w0.762: U11.7 69.86,68.16 v1(69.95,68.24)
  Bottom Layer w0.762: v1(69.95,68.24) R28.2 R19.1
$1N36658: length 4.3
  Top Layer w0.635: v1(86.58,30.39) U15.7
  Bottom Layer w0.762: v1(86.58,30.39) 86.58,31.78 R40.2 R34.1
$1N36809: length 4.3
  Top Layer w0.635: v1(70.96,30.27) 71.01,30.32 U16.7
  Bottom Layer w0.762: v1(70.96,30.27) 70.95,30.28 R42.2 R36.1
$1N37466: length 13.4
  Bottom Layer w0.762: R34.2 83.27,33.44 77.61,39.11 H7.2
$1N37572: length 16.7
  Bottom Layer w0.762: 65.37,53.89 62.83,53.89 54.69,62.03 R17.2
$1N37631: length 16.6
  Bottom Layer w0.762: H1.2 13.3,53.76 4.4,62.66 R1.2
$1N37690: length 16.5
  Bottom Layer w0.762: R4.2 21.29,63.04 30.44,53.89 32.35,53.89
$1N37749: length 17.8
  Bottom Layer w0.762: R7.2 37.93,60.88 45.05,53.76 H3.2
$1N37808: length 19.9
  Bottom Layer w0.762: R22.2 85.06,57.06 91.66,50.46 H6.2
$1N37867: length 14.4
  Bottom Layer w0.762: H8.2 62.06,37.63 66.51,33.19 R36.2
$1N37927: length 15.7
  Bottom Layer w0.762: R19.2 71.45,62.41 79.84,54.02 H5.2
$1N42054: length 1.5
  Top Layer w0.508: R31.1 90.46,21.11
$1N42156: length 1.5
  Top Layer w0.508: R33.1 71.71,20.85 LED7.1
$1N42254: length 1.5
  Top Layer w0.508: R16.1 63.53,75.47
$1N43125: length 18.6
  Top Layer w1.397: Q1.1 v1(17.26,31.03)
  Bottom Layer w1.397: SW1.2 10.25,23.66 16.67,30.45 v1(17.26,31.03)
$1N43127: length 9.7
  Top Layer w0.508: 9.61,25.2 R38.2 7.7,23.65 4.28,20.23 SW1.3
$1N43793: length 3.5
  Top Layer w0.508: R3.1 17.23,74.85 17.23,72.6 LED1.1
$1N43891: length 1.6
  Top Layer w0.508: LED2.1 R6.1
$1N43990: length 1.5
  Top Layer w0.508: R9.1 47.43,75.35 LED3.1
$1N44088: length 1.6
  Top Layer w0.508: R24.1 98.54,70.04 LED6.1
$1N44287: length 1.6
  Top Layer w0.508: R21.1 79.59,75.33 LED5.1
$1N44383: length 1.5
  Top Layer w0.762: R37.1 LED9.1
$2N2: length 1.9
  Top Layer w0.508: R55.1 37.16,24.31 36.66,24.81 R54.2
$2N4: length 3.5
  Top Layer w0.254: 30.57,29.84 31.72,29.84 32.02,30.14 32.91,30.14 ; R46.1 C53.1
$2N17: length 6.6
  Top Layer w0.254: C61.1 R49.1 36.92,27.34 35.38,28.88 U25.10
$2N22: length 1
  Top Layer w0.254: C62.1 39.85,26.33 R49.2
$2N33: length 4.5
  Top Layer w0.254: R47.1 R44.1 39.84,30.66 U25.12
$2N37: length 1.5
  Top Layer w0.254: J1.1 35.38,34.46 35.38,32.98
$2N39: length 4.2
  Top Layer w0.254: C49.1 37.16,33.43 36.46,32.73 U25.15
$2N41: length 0.8
  Top Layer w0.508: R52.1 R54.1
$2N43: length 0.8
  Top Layer w0.508: R51.1 R53.2
$2N500: length 4.6
  Top Layer w0.254: C54.1 37.3,28.49 36.46,29.33 U25.11
$2N3054: length 1.7
  Top Layer w0.254: 33.88,32.98 33.87,32.99 R43.1
$2N4928: length 11.9
  Top Layer w0.254: R44.2 v1(41.62,30.65)
  Bottom Layer w0.254: v1(41.62,30.65) 41.62,21.12 42.76,19.98
$2N6158: length 1.5
  Top Layer w0.508: R45.1 LED10.1

## Copper pours and planes (outline as drawn; the poured copper is in the pictures)
GND on Top Layer: -3.85,85.89 103.34,85.89 103.34,-4.02 -3.85,-4.02
GND on Bottom Layer: -6.01,86.4 103.59,86.4 103.59,-6.94 -6.01,-6.94
VCC on Top Layer: outline of 289 points within -0.04,1.96 90.26,62.79
VCCIN on Top Layer: 22.82,40.81 23.18,40.96 23.33,41.32 23.33,47.16 23.18,47.52 22.82,47.67 0.34,47.67 -0.02,47.52 -0.17,47.16 -0.17,27.09 -0.02,26.73 0.34,26.58 13.53,26.58 13.89,26.73 14.04,27.09 14.04,32.3 13.89,32.66 13.53,32.81 12.41,32.81 12.05,32.96 11.9,33.31 11.9,40.3 12.05,40.66 12.41,40.81
VCCIN on Bottom Layer: 18.76,46.45 17.61,47.59 -0.04,47.59 -0.04,26.33 10,26.33 13.04,29.38 13.04,39.28 17.46,39.28 18.76,40.58
VOUT on Top Layer: 44.54,3.6 44.18,3.75 44.03,4.1 44.03,5.63 44.18,5.99 44.54,6.14 45.57,6.14 45.93,6.29 46.08,6.65 46.08,24.3 46.23,24.66 46.59,24.81 53.68,24.81 54.04,24.66 54.19,24.3 54.19,6.65 54.34,6.29 54.7,6.14 56.73,6.14 57.09,5.99 57.24,5.63 57.24,4.1 57.09,3.75 56.73,3.6
VOUT1 on Top Layer: 4.53,69 4.68,68.64 5.04,68.49 6.06,68.49 6.42,68.35 6.57,67.99 6.57,66.72 6.71,66.36 7.07,66.21 8.09,66.21 8.45,66.06 8.6,65.7 8.6,65.45 8.75,65.09 9.11,64.94 15.08,64.94 15.43,65.09 15.58,65.45 15.58,69.26 15.43,69.62 15.08,69.76 12.66,69.76 12.3,69.91 12.15,70.27 12.15,74.34 12.3,74.7 12.66,74.84 14.19,74.84 14.55,74.99 14.69,75.35 14.69,80.18 14.55,80.54 14.19,80.69 12.7,80.69 12.34,80.54 12.19,80.18 12.19,78.27 12.04,77.91 11.68,77.77 7.96,77.77 7.6,77.62 7.45,77.26 7.45,72.05 7.31,71.69 6.95,71.54 5.04,71.54 4.68,71.39 4.53,71.03
VOUT1-3.3 on Top Layer: 60.03,3.59 59.67,3.74 59.53,4.1 59.53,32.93 59.67,33.29 60.03,33.44 64.86,33.44 65.22,33.29 65.37,32.93 65.37,29.63 65.44,29.45 65.62,29.38 66,29.38 66.18,29.3 66.26,29.12 66.26,22.77 66.4,22.41 66.76,22.27 70.19,22.27 70.55,22.12 70.7,21.76 70.7,6.95 70.85,6.59 71.21,6.44 72.27,6.44 72.63,6.3 72.78,5.94 72.78,4.1 72.63,3.74 72.27,3.59
VOUT1-5 on Top Layer: 75.65,32.93 75.8,33.29 76.16,33.44 80.99,33.44 81.35,33.29 81.5,32.93 81.5,29.63 81.57,29.45 81.75,29.38 82.13,29.38 82.31,29.3 82.38,29.12 82.38,22.77 82.53,22.41 82.89,22.27 87.5,22.27 87.86,22.12 88.01,21.76 88.01,4.18 87.86,3.82 87.5,3.68 75.65,3.68 75.29,3.82 75.15,4.18 75.15,5.88 75.22,6.06 75.58,6.21 75.65,6.39
VOUT2 on Top Layer: 23.2,66.72 23.35,66.36 23.71,66.21 24.85,66.21 25.21,66.06 25.36,65.7 25.36,65.45 25.51,65.09 25.87,64.94 31.84,64.94 32.2,65.09 32.35,65.45 32.35,67.73 32.2,68.09 31.84,68.24 29.55,68.24 29.19,68.39 29.04,68.75 29.04,79.67 28.9,80.03 28.54,80.18 27.39,80.18 27.03,80.03 26.89,79.67 26.89,76.63 26.74,76.27 26.38,76.12 22.7,76.12 22.7,68.49 23.2,68.49
VOUT3 on Top Layer: 43.14,80.41 43.5,80.26 43.65,79.9 43.65,76.62 43.8,76.26 44.16,76.11 44.54,76.11 44.9,75.97 45.05,75.61 45.05,68.88 45.2,68.52 45.56,68.37 48.01,68.37 48.37,68.22 48.52,67.86 48.52,65.19 48.37,64.83 48.01,64.68 44.01,64.68 43.65,64.83 43.5,65.19 43.5,65.7 43.35,66.06 43,66.21 40.47,66.21 40.12,66.36 39.97,66.72 39.97,68.11 39.82,68.47 39.46,68.62 38.7,68.62 38.34,68.77 38.19,69.13 38.19,75.61 38.34,75.97 38.7,76.11 40.89,76.11 41.25,76.26 41.4,76.62 41.4,79.9 41.55,80.26 41.91,80.41
VOUT6 on Top Layer: 100,65.22 96.87,65.22 93.67,65.22 93.31,65.37 93.16,65.72 93.16,65.83 93.02,66.19 92.66,66.33 90.51,66.33 90.15,66.48 90,66.84 90,69.15 89.86,69.51 89.5,69.66 87.08,69.66 86.72,69.81 86.58,70.17 86.58,74.34 86.43,74.7 86.07,74.84 85.56,74.84 85.2,74.99 85.05,75.35 85.05,79.9 85.2,80.26 85.56,80.41 86.83,80.41 87.19,80.26 87.34,79.9 87.34,77.64 87.49,77.28 87.85,77.13 89.37,77.13 89.73,76.98 89.88,76.62 89.88,75.1 90.03,74.74 90.39,74.59 92.42,74.59 92.78,74.44 92.93,74.08 92.93,68.88 93.07,68.52 93.43,68.37 97.79,68.37 97.79,69.07 100,69.07
$1N1041 on Top Layer: 3.82,62.53 3.9,62.7 4.08,62.78 4.53,62.78 4.71,62.7 4.79,62.53 4.79,60.62 5.01,60.08 5.55,59.86 8.98,59.86 9.52,60.08 9.74,60.62 9.74,62.14 9.96,62.68 10.5,62.91 14.19,62.91 14.72,62.68 14.95,62.14 14.95,58.72 14.72,58.18 14.19,57.95 4.59,57.95 4.05,58.18 3.82,58.72
$1N2957 on Top Layer: 20.46,62.53 20.54,62.7 20.72,62.78 21.17,62.78 21.35,62.7 21.42,62.53 21.42,60.37 21.57,60.01 21.93,59.86 25.87,59.86 26.23,60.01 26.38,60.37 26.38,62.4 26.53,62.76 26.89,62.91 31.08,62.91 31.44,62.76 31.59,62.4 31.59,58.46 31.44,58.1 31.08,57.95 20.97,57.95 20.61,58.1 20.46,58.46
$1N3280 on Top Layer: 37.22,62.53 37.3,62.7 37.48,62.78 37.94,62.78 38.11,62.7 38.19,62.53 38.19,60.37 38.34,60.01 38.7,59.86 42.63,59.86 42.99,60.01 43.14,60.37 43.14,62.4 43.29,62.76 43.65,62.91 47.84,62.91 48.2,62.76 48.35,62.4 48.35,58.46 48.2,58.1 47.84,57.95 37.73,57.95 37.37,58.1 37.22,58.46
$1N3603 on Top Layer: 53.99,62.53 54.06,62.7 54.24,62.78 54.7,62.78 54.88,62.7 54.95,62.53 54.95,60.37 55.1,60.01 55.46,59.86 59.4,59.86 59.76,60.01 59.91,60.37 59.91,62.4 60.05,62.76 60.41,62.91 64.6,62.91 64.96,62.76 65.11,62.4 65.11,58.46 64.96,58.1 64.6,57.95 54.5,57.95 54.14,58.1 53.99,58.46
$1N3926 on Top Layer: 87.39,62.53 87.46,62.7 87.64,62.78 88.1,62.78 88.28,62.7 88.35,62.53 88.35,60.37 88.5,60.01 88.86,59.86 92.8,59.86 93.16,60.01 93.31,60.37 93.31,62.4 93.46,62.76 93.81,62.91 98.01,62.91 98.37,62.76 98.51,62.4 98.51,58.46 98.37,58.1 98.01,57.95 87.9,57.95 87.54,58.1 87.39,58.46
$1N4249 on Top Layer: 70.75,62.53 70.83,62.7 71.01,62.78 71.46,62.78 71.64,62.7 71.72,62.53 71.72,60.37 71.87,60.01 72.22,59.86 76.16,59.86 76.52,60.01 76.67,60.37 76.67,62.4 76.82,62.76 77.18,62.91 81.37,62.91 81.73,62.76 81.88,62.4 81.88,58.46 81.73,58.1 81.37,57.95 71.26,57.95 70.9,58.1 70.75,58.46
$1N11485 on Top Layer: 85.31,35.86 85.67,36 85.81,36.36 85.81,39.16 85.67,39.52 85.31,39.66 75.78,39.66 75.42,39.52 75.27,39.16 75.27,36.24 75.42,35.88 75.78,35.73 78.96,35.73 79.32,35.88 79.46,36.24 79.46,37.89 79.61,38.25 79.97,38.39 84.16,38.39 84.52,38.25 84.67,37.89 84.67,36.36 84.82,36 85.18,35.86
$1N11809 on Top Layer: 70.04,36 70.19,36.36 70.19,39.16 70.04,39.52 69.69,39.66 59.78,39.66 59.42,39.52 59.27,39.16 59.27,36.24 59.42,35.88 59.78,35.73 62.95,35.73 63.31,35.88 63.46,36.24 63.46,37.89 63.61,38.25 63.97,38.39 68.67,38.39 69.03,38.25 69.18,37.89 69.18,36.36 69.33,36 69.69,35.86
$2N9 on Top Layer: 50.89,34.2 51.25,34.06 51.4,33.7 51.4,31.03 51.25,30.67 50.89,30.52 43.65,30.52 43.47,30.6 43.32,30.95 43.14,31.03 36.17,31.03 35.99,31.1 35.92,31.28 35.92,31.54 35.99,31.72 36.17,31.79 37.05,31.79 37.23,31.87 37.3,32.05 37.3,32.55 37.37,32.72 37.55,32.8 46.06,32.8 46.42,32.95 46.57,33.31 46.57,33.7 46.72,34.06 47.08,34.2
VOUT4 on Top Layer: 61.05,68.88 61.2,68.52 61.56,68.37 64.1,68.37 64.46,68.22 64.6,67.86 64.6,65.7 64.46,65.34 64.1,65.19 59.26,65.19 58.9,65.34 58.6,66.06 58.24,66.21 57.15,66.21 56.8,66.36 56.65,66.72 56.65,69.76 56.5,70.12 56.14,70.27 54.95,70.27 54.59,70.42 54.44,70.78 54.44,74.94 54.59,75.3 54.95,75.45 55.46,75.45 55.82,75.6 55.97,75.96 55.97,79.92 56.12,80.28 56.48,80.43 57.75,80.43 58.11,80.28 58.25,79.92 58.25,77.51 61.05,77.51
VOUT5 on Top Layer: 77.01,68.75 77.16,68.39 77.52,68.24 81.37,68.24 81.73,68.09 81.88,67.73 81.88,65.7 81.73,65.34 81.37,65.19 77.05,65.19 76.69,65.34 76.54,65.7 76.54,65.83 76.39,66.19 76.03,66.33 73.88,66.33 73.52,66.48 73.37,66.84 73.37,68.52 73.22,68.88 72.86,69.02 71.08,69.02 70.72,69.17 70.57,69.53 70.57,79.92 70.72,80.28 71.08,80.43 72.22,80.43 72.58,80.28 72.73,79.92 72.73,77 77.01,77

Small or netless copper shapes (teardrops, artwork), in the pictures only: 91 on Top Layer, 56 on Bottom Layer

## Text on the board
Top Solder Mask Layer: DCDC-buck | TI
Top Silkscreen Layer: 3v3 | 5v | ON | pwr | on | 1 | 5 | 6 | 2 | 3 | 4 | g | vcc | gnd | + | - | VOUT | 5V | max 8A | max 3a | 6-channel servo | servo | input | 开
